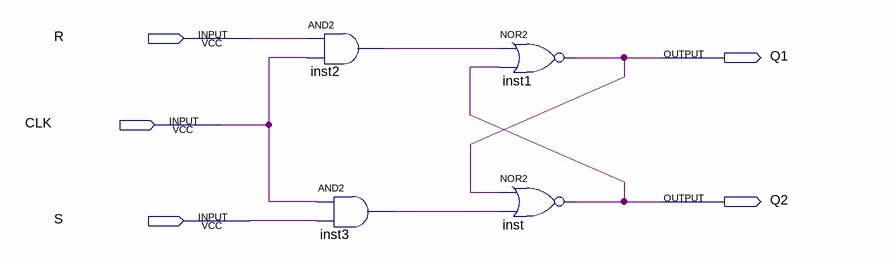
[diagram p0: schematic sheet]
// Quartus schematic flipflop_RS_nor.bdf as structural Verilog: 4 symbols, 5 pins
module flipflop_RS_nor (
  input  R,
  input  CLK,
  input  S,
  output Q1,
  output Q2
);

  wire inst2_out, inst3_out;

  and inst2 (inst2_out, R, CLK);
  and inst3 (inst3_out, CLK, S);
  nor inst1 (Q1, inst2_out, Q2);
  nor inst (Q2, Q1, inst3_out);
endmodule
